# EAGLE design ADC_FPGA_I2C (EAGLE 9.5.2)
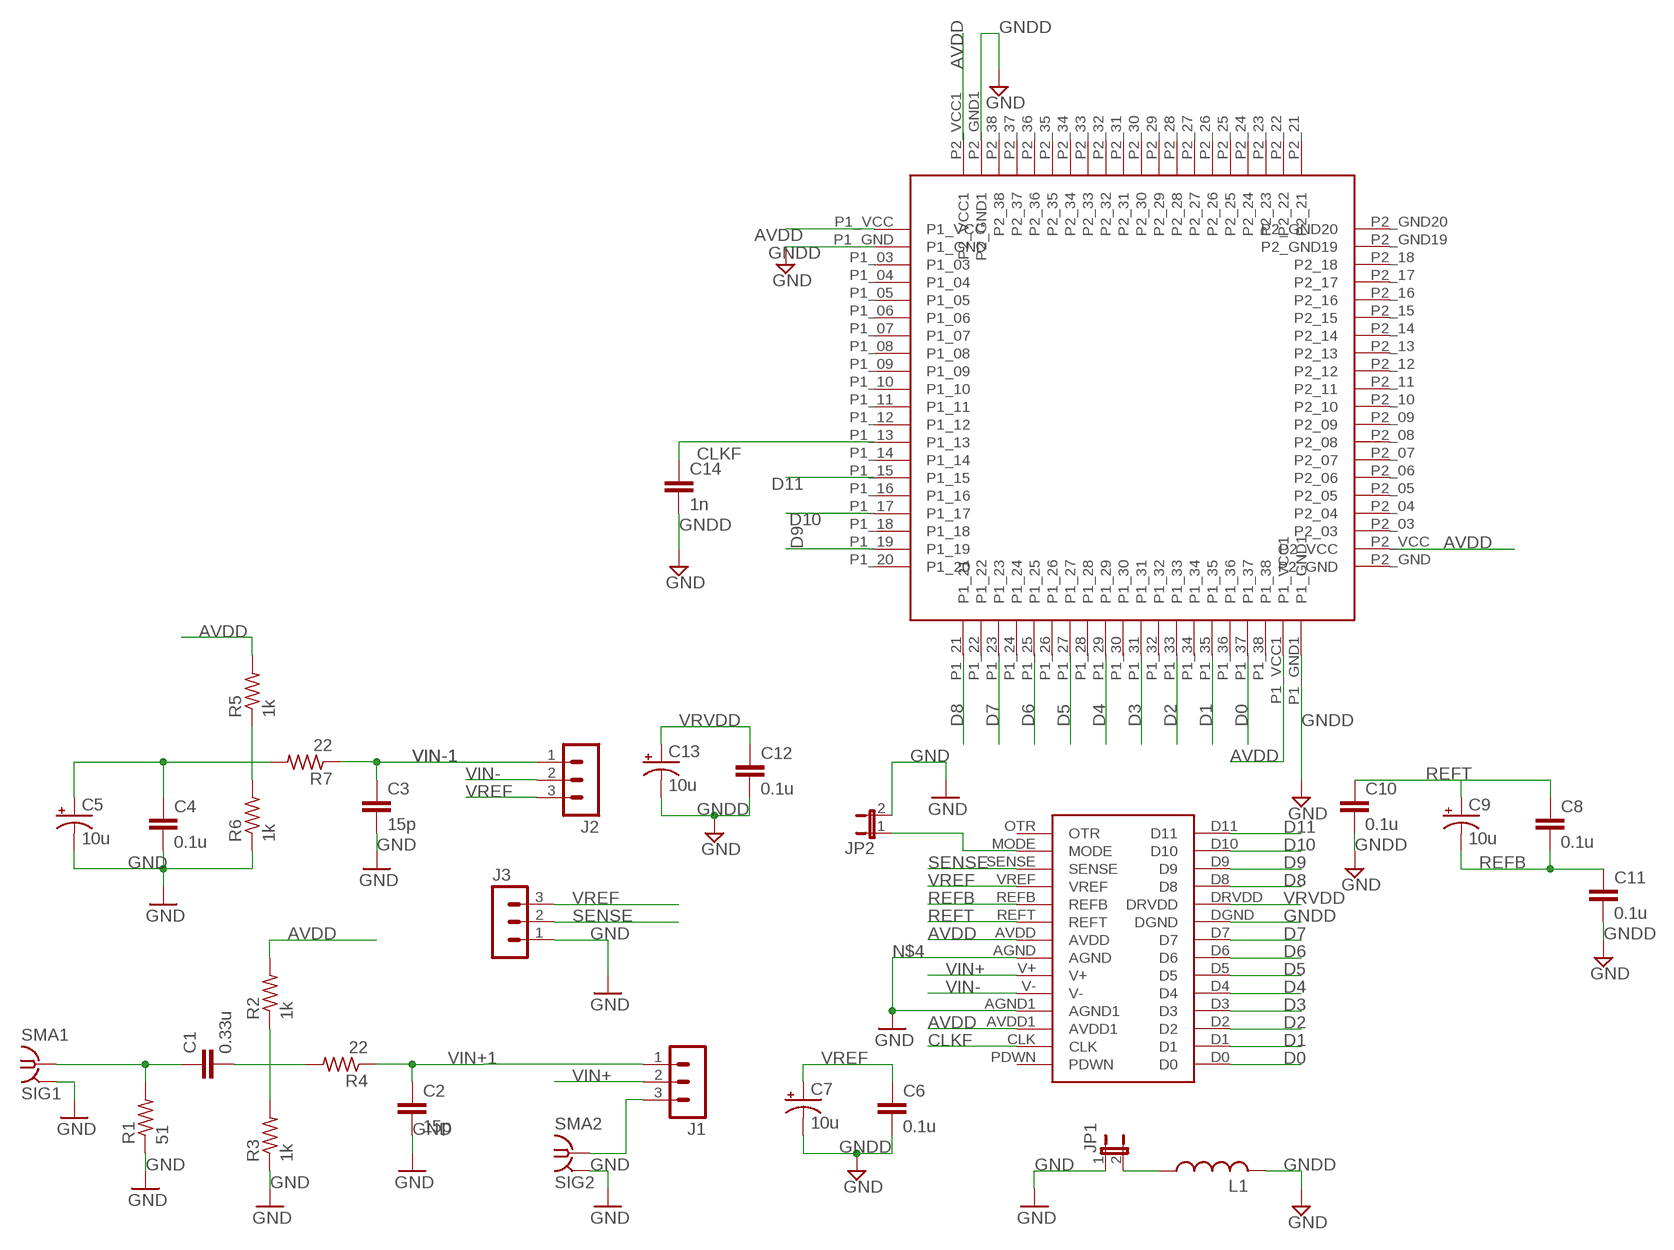
[diagram p0: schematic, sheet 1]

## Parts
C1  0.33u  C-EU075-063X106  [C075-063X106]
C2  15p  C-EU050-024X044  [C050-024X044]
C3  15p  C-EU050-024X044  [C050-024X044]
C4  0.1u  C-EU050-024X044  [C050-024X044]
C5  10u  CPOL-USE2.5-5  [E2,5-5]
C6  0.1u  C-EU050-024X044  [C050-024X044]
C7  10u  CPOL-USE2.5-5  [E2,5-5]
C8  0.1u  C-EU050-024X044  [C050-024X044]
C9  10u  CPOL-USE2.5-5  [E2,5-5]
C10  0.1u  C-EU050-024X044  [C050-024X044]
C11  0.1u  C-EU050-024X044  [C050-024X044]
C12  0.1u  C-EU050-024X044  [C050-024X044]
C13  10u  CPOL-USE2.5-5  [E2,5-5]
C14  1n  C-EU050-024X044  [C050-024X044]
J1  MA03-1  [MA03-1]
J2  MA03-1  [MA03-1]
J3  MA03-1  [MA03-1]
JP1  JP1E  [JP1]
JP2  JP1E  [JP1]
L1  L-US0204/7  [0204/7]
R1  51  R-US_0207/10  [0207/10]
R2  1k  R-US_0207/10  [0207/10]
R3  1k  R-US_0207/10  [0207/10]
R4  22  R-US_0207/10  [0207/10]
R5  1k  R-US_0207/10  [0207/10]
R6  1k  R-US_0207/10  [0207/10]
R7  22  R-US_0207/10  [0207/10]
SMA1  SIG1  SMA-142-0701-871/880  [SMA-142-0701-871]
SMA2  SIG2  SMA-142-0701-871/880  [SMA-142-0701-871]
U$1  AD9235  [AD9235]
U$2  SPARTAN_6_NIMAS  [SPARTAN_6_NIMAS]

## Nets
AVDD: R2.2 R5.2 U$1.AVDD U$1.AVDD1 U$2.P1_VCC U$2.P1_VCC1 U$2.P2_VCC U$2.P2_VCC1
CLKF: C14.1 U$1.CLK U$2.P1_13
D0: U$1.D0 U$2.P1_37
D1: U$1.D1 U$2.P1_35
D2: U$1.D2 U$2.P1_33
D3: U$1.D3 U$2.P1_31
D4: U$1.D4 U$2.P1_29
D5: U$1.D5 U$2.P1_27
D6: U$1.D6 U$2.P1_25
D7: U$1.D7 U$2.P1_23
D8: U$1.D8 U$2.P1_21
D9: U$1.D9 U$2.P1_19
D10: U$1.D10 U$2.P1_17
D11: U$1.D11 U$2.P1_15
GND: C2.2 C3.2 C4.2 C5.- J3.1 JP1.1 JP2.2 R1.1 R3.1 R6.1 SMA1.2@1 SMA1.2@2 SMA1.2@3 SMA1.2@4 SMA2.2@1 SMA2.2@2 SMA2.2@3 SMA2.2@4
GNDD: C6.2 C7.- C10.2 C11.2 C12.2 C13.- C14.2 L1.2 U$1.DGND U$2.P1_GND U$2.P1_GND1 U$2.P2_GND1 ; supply symbol labelled GND
N$1: C1.1 R1.2 SMA1.1
N$2: C1.2 R4.2
N$3: R2.1 R3.2
N$4: U$1.AGND U$1.AGND1 ; supply symbol labelled GND
N$5: J1.3 SMA2.1
N$7: C4.1 C5.+ R7.2
N$8: R5.1 R6.2
N$9: JP1.2 L1.1
N$10: JP2.1 U$1.MODE
REFB: C8.2 C9.- C11.1 U$1.REFB
REFT: C8.1 C9.+ C10.1 U$1.REFT
SENSE: J3.2 U$1.SENSE
VIN+: J1.2 U$1.V+
VIN+1: C2.1 J1.1 R4.1
VIN-: J2.2 U$1.V-
VIN-1: C3.1 J2.1 R7.1
VREF: C6.1 C7.+ J2.3 J3.3 U$1.VREF
VRVDD: C12.1 C13.+ U$1.DRVDD
Unconnected: U$1.OTR U$1.PDWN U$2.P1_03 U$2.P1_04 U$2.P1_05 U$2.P1_06 U$2.P1_07 U$2.P1_08 U$2.P1_09 U$2.P1_10 U$2.P1_11 U$2.P1_12 U$2.P1_14 U$2.P1_16 U$2.P1_18 U$2.P1_20 U$2.P1_22 U$2.P1_24 U$2.P1_26 U$2.P1_28 U$2.P1_30 U$2.P1_32 U$2.P1_34 U$2.P1_36 U$2.P1_38 U$2.P2_03 U$2.P2_04 U$2.P2_05 U$2.P2_06 U$2.P2_07 U$2.P2_08 U$2.P2_09 U$2.P2_10 U$2.P2_11 U$2.P2_12 U$2.P2_13 U$2.P2_14 U$2.P2_15 U$2.P2_16 U$2.P2_17 U$2.P2_18 U$2.P2_21 U$2.P2_22 U$2.P2_23 U$2.P2_24 U$2.P2_25 U$2.P2_26 U$2.P2_27 U$2.P2_28 U$2.P2_29 U$2.P2_30 U$2.P2_31 U$2.P2_32 U$2.P2_33 U$2.P2_34 U$2.P2_35 U$2.P2_36 U$2.P2_37 U$2.P2_38 U$2.P2_GND U$2.P2_GND19 U$2.P2_GND20

## Library data of the parts
C1-C4 C6 C8 C10-C12 C14 = rcl:C-EU: CAPACITOR, European symbol; SPICEPREFIX: C
C5 C7 C9 C13 = rcl:CPOL-US: POLARIZED CAPACITOR, American symbol; SPICEPREFIX: C
J1-J3 = con-lstb:MA03-1: PIN HEADER; OC_FARNELL: unknown; OC_NEWARK: unknown
JP1 JP2 = jumper:JP1E: JUMPER
L1 = rcl:L-US: INDUCTOR, American symbol; SPICEPREFIX: L
R1-R7 = rcl:R-US_: RESISTOR, American symbol; SPICEPREFIX: R
SMA1 SMA2 = con-coax:SMA-: SMA 50 Ohm End Launch Jack Receptacle - Round Contact Johnson Components Source: www.johnsoncomponents.com .. J502-ND.pdf; MF: JOHNSON COMPONENTS; MPN: 142-0701-871; OC_FARNELL: 1339835; OC_NEWARK: 91B6105
U$1 = AD9235:AD9235
U$2 = SPARTAN_6_NIMAS:SPARTAN_6_NIMAS

## Board
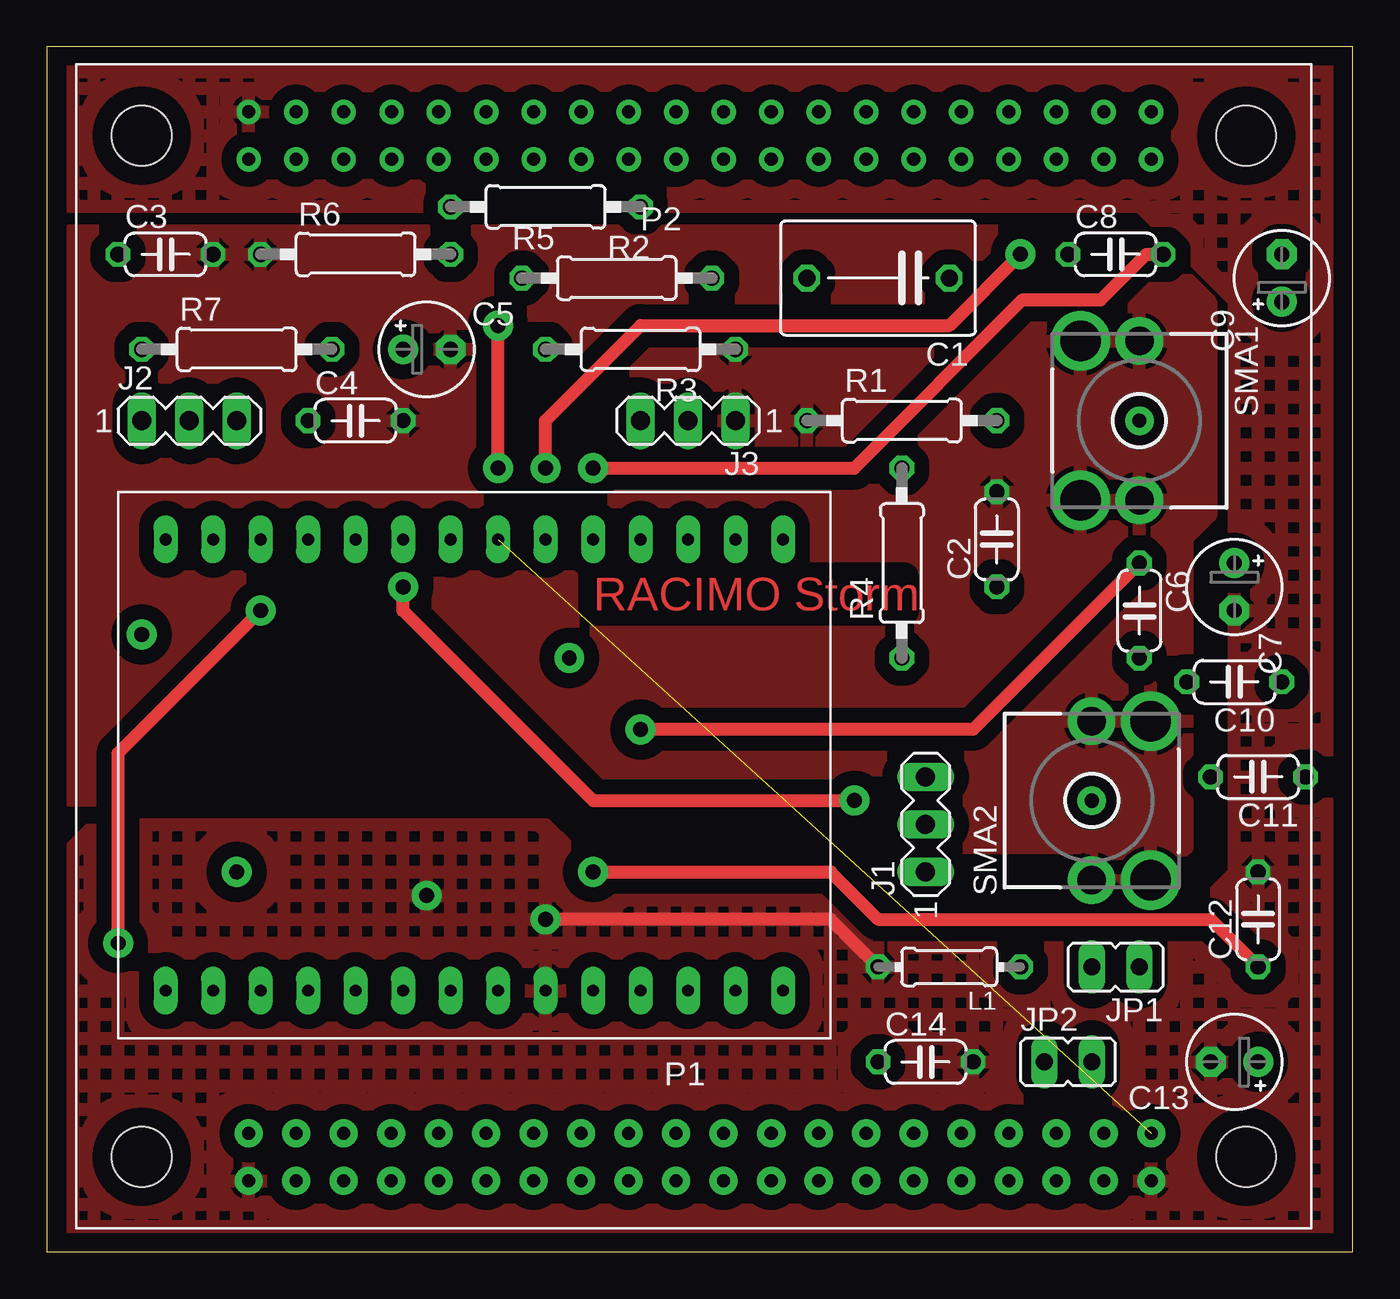
[diagram p1: board, top side]
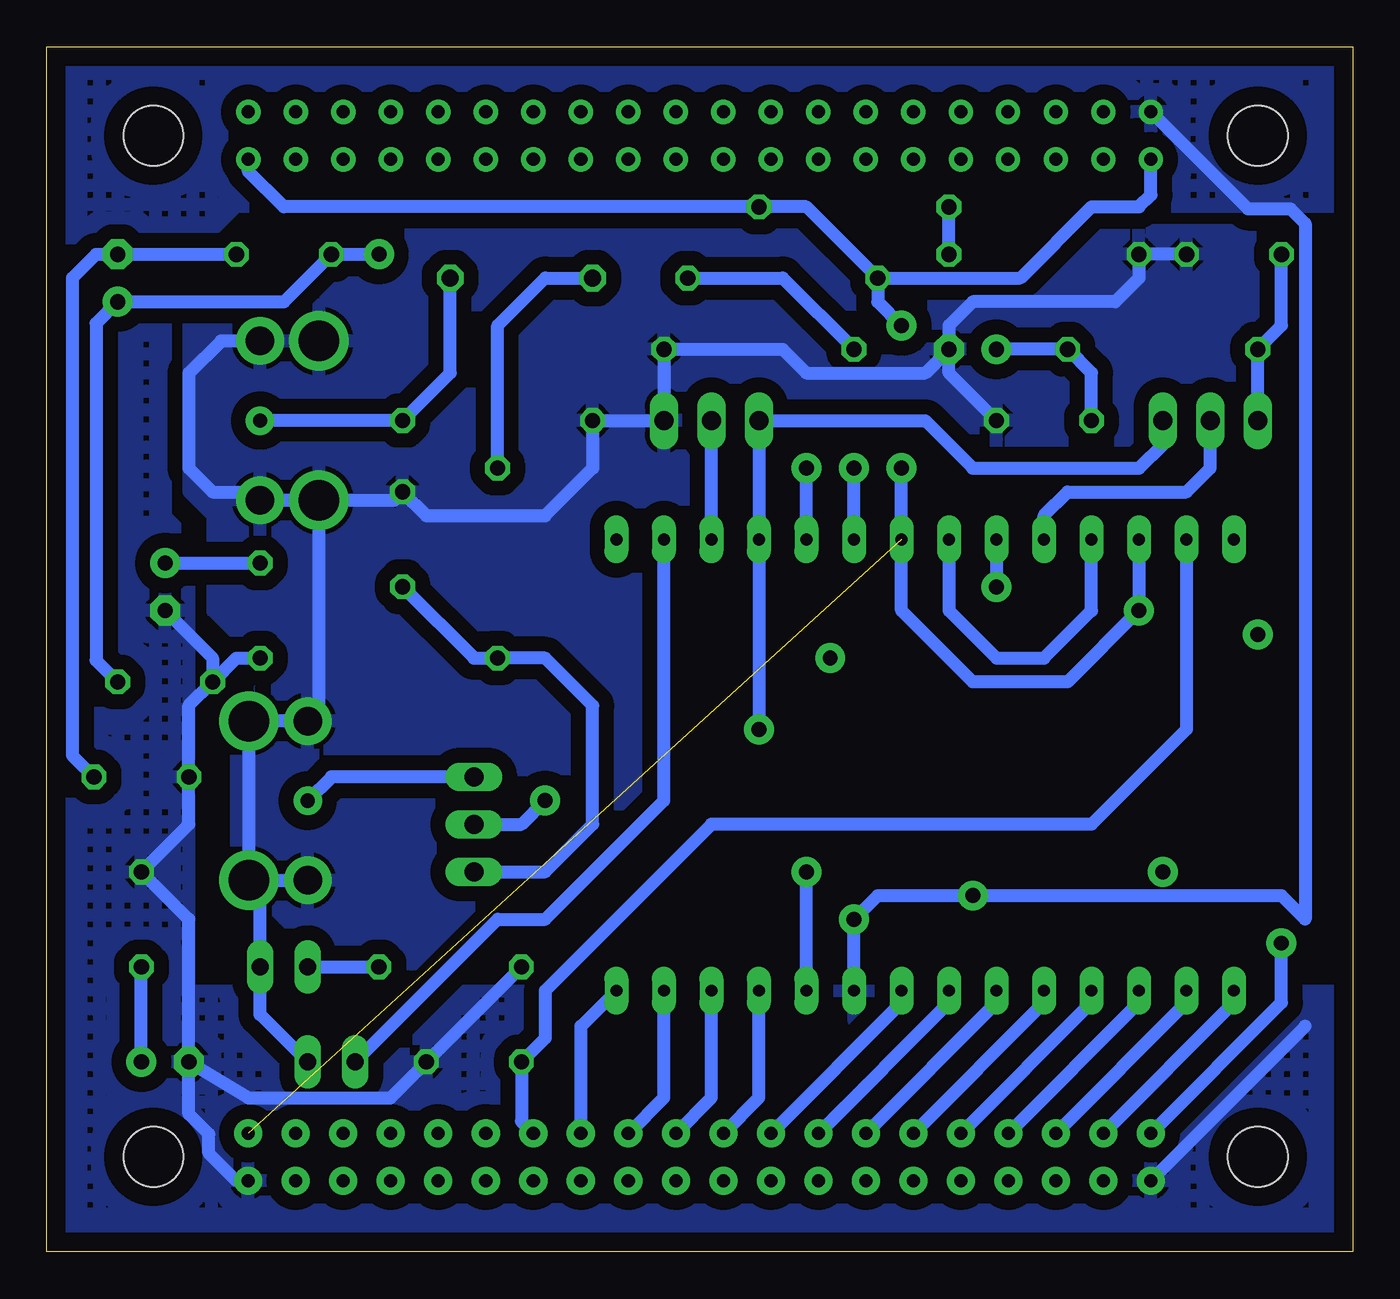
[diagram p2: board, bottom side, seen from below]

Size 69.83 x 64.44 mm. Coordinates in mm from the lower left corner, seen from the top.
Outline: 0,0 69.83,0 69.83,64.44 0,64.44 0,0
Copper layers (1*16): Top 0.035mm / dielectric 1.5mm / Bottom 0.035mm
Design rules "default": minimum track width 6mil, minimum drill 0.35mm, track to track 6mil, track to pad 6mil, pad to pad 6mil, via to via 6mil, smd to smd 6mil, copper to edge 40mil, drill to drill 6mil, minimum pad ring 10mil, minimum via ring 8mil, stop-mask expansion 4mil, vias tented up to drill 0mil, thermal gap 10mil

### Footprints (pad centres in the part's own frame; a part is rotated, then mirrored left to right if it is on the bottom)
C075-063X106 = drill 0.914 octagon: 1 -3.81,0; 2 3.81,0
C050-024X044 = drill 0.813 octagon: 1 -2.54,0; 2 2.54,0
E2,5-5 = drill 0.813 pad 1.6: + -1.27,0 | drill 0.813 pad 1.6 octagon: - 1.27,0
MA03-1 = drill 1.016 long: 1 -2.54,0; 2 0,0; 3 2.54,0
JP1 = drill 0.914 long: 1 0,-1.27; 2 0,1.27
0204/7 = drill 0.813 octagon: 1 -3.81,0; 2 3.81,0
0207/10 = drill 0.813 octagon: 1 -5.08,0; 2 5.08,0
SMA-142-0701-871 = drill 0.762 pad 1.524: 1 0,0 | drill 1.524 pad 2.54: 2@1 -4.255,0; 2@2 4.255,0 | drill 2.159 pad 2.794: 2@3 -4.255,-3.15; 2@4 4.255,-3.15
AD9235 = drill 0.635 pad 1.27 long: AGND 0,-17.78; AGND1 0,-25.4; AVDD 0,-15.24; AVDD1 0,-27.94; CLK 0,-30.48; D0 24.13,-33.02; D1 24.13,-30.48; D2 24.13,-27.94; D3 24.13,-25.4; D4 24.13,-22.86; D5 24.13,-20.32; D6 24.13,-17.78; D7 24.13,-15.24; D8 24.13,-7.62; D9 24.13,-5.08; D10 24.13,-2.54; D11 24.13,0; DGND 24.13,-12.7; DRVDD 24.13,-10.16; MODE 0,-2.54; OTR 0,0; PDWN 0,-33.02; REFB 0,-10.16; REFT 0,-12.7; SENSE 0,-5.08; V+ 0,-20.32; V- 0,-22.86; VREF 0,-7.62
SPARTAN_6_NIMAS = drill 0.7 pad 1.5: P1_03 51.435,-53.34; P1_04 51.435,-55.88; P1_05 48.895,-53.34; P1_06 48.895,-55.88; P1_07 46.355,-53.34; P1_08 46.355,-55.88; P1_09 43.815,-53.34; P1_10 43.815,-55.88; P1_11 41.275,-53.34; P1_12 41.275,-55.88; P1_13 38.735,-53.34; P1_14 38.735,-55.88; P1_15 36.195,-53.34; P1_16 36.195,-55.88; P1_17 33.655,-53.34; P1_18 33.655,-55.88; P1_19 31.115,-53.34; P1_20 31.115,-55.88; P1_21 28.575,-53.34; P1_22 28.575,-55.88; P1_23 26.035,-53.34; P1_24 26.035,-55.88; P1_25 23.495,-53.34; P1_26 23.495,-55.88; P1_27 20.955,-53.34; P1_28 20.955,-55.88; P1_29 18.415,-53.34; P1_30 18.415,-55.88; P1_31 15.875,-53.34; P1_32 15.875,-55.88; P1_33 13.335,-53.34; P1_34 13.335,-55.88; P1_35 10.795,-53.34; P1_36 10.795,-55.88; P1_37 8.255,-53.34; P1_38 8.255,-55.88; P1_GND 53.975,-55.88; P1_GND1 5.715,-55.88; P1_VCC 53.975,-53.34; P1_VCC1 5.715,-53.34 | drill 0.7 pad 1.3: P2_03 51.435,1.27; P2_04 51.435,-1.27; P2_05 48.895,1.27; P2_06 48.895,-1.27; P2_07 46.355,1.27; P2_08 46.355,-1.27; P2_09 43.815,1.27; P2_10 43.815,-1.27; P2_11 41.275,1.27; P2_12 41.275,-1.27; P2_13 38.735,1.27; P2_14 38.735,-1.27; P2_15 36.195,1.27; P2_16 36.195,-1.27; P2_17 33.655,1.27; P2_18 33.655,-1.27; P2_21 28.575,1.27; P2_22 28.575,-1.27; P2_23 26.035,1.27; P2_24 26.035,-1.27; P2_25 23.495,1.27; P2_26 23.495,-1.27; P2_27 20.955,1.27; P2_28 20.955,-1.27; P2_29 18.415,1.27; P2_30 18.415,-1.27; P2_31 15.875,1.27; P2_32 15.875,-1.27; P2_33 13.355,1.27; P2_34 13.355,-1.27; P2_35 10.795,1.27; P2_36 10.795,-1.27; P2_37 8.255,1.27; P2_38 8.255,-1.27; P2_GND 53.975,1.27; P2_GND1 5.715,1.27; P2_GND19 31.115,1.27; P2_GND20 31.115,-1.27; P2_VCC 53.975,-1.27; P2_VCC1 5.715,-1.27 | hole 3.2: 0,0; 0,-54.61; 59.05,0; 59.05,-54.61

### Placement (x,y rotation side)
C1  44.45,52.07 180 top
C2  50.8,38.1 90 top
C3  6.35,53.34 0 top
C4  16.51,44.45 0 top
C5  20.32,48.26 0 top
C6  58.42,34.29 270 top
C7  63.5,35.56 270 top
C8  57.15,53.34 0 top
C9  66.04,52.07 90 top
C10  63.5,30.48 180 top
C11  64.77,25.4 180 top
C12  64.77,17.78 90 top
C13  63.5,10.16 180 top
C14  46.99,10.16 0 top
J1  46.99,22.86 90 top
J2  7.62,44.45 0 top
J3  34.29,44.45 180 top
JP1  57.15,15.24 90 top
JP2  54.61,10.16 270 top
L1  48.26,15.24 180 top
R1  45.72,44.45 0 top
R2  30.48,52.07 180 top
R3  31.75,48.26 180 top
R4  45.72,36.83 90 top
R5  26.67,55.88 0 top
R6  16.51,53.34 0 top
R7  10.16,48.26 0 top
SMA1  58.42,44.45 270 top
SMA2  55.88,24.13 90 top
U$1  39.37,38.1 270 top
U$2  5.08,59.69 0 top

### Tracks (layer width: path | path; a pad name or v marks a point on that pad's centre or on a via)
AVDD  (via drill 0.8 pad 1.6)  (1 unrouted)
  Top 0.7: v24.13,41.91 v24.13,49.53 | v3.81,16.51 3.81,26.67 v11.43,34.29
  Bottom 0.7: R2.2 29.21,55.88 R5.2 57.15,55.88 59.05,57.78 U$2.P2_VCC | R2.2 17.78,52.07 13.97,55.88 11.43,55.88 10.79,56.52 U$2.P2_VCC1 | U$1.AVDD1 v11.43,34.29 15.24,30.48 20.32,30.48 24.13,34.29 U$1.AVDD v24.13,41.91 | R2.2 25.4,50.8 v24.13,49.53 | U$2.P1_VCC1 3.81,13.34 v3.81,16.51
CLKF
  Bottom 0.7: U$1.CLK 8.89,27.94 13.97,22.86 34.29,22.86 43.18,13.97 43.18,11.43 C14.1 44.45,6.99 U$2.P1_13
D0
  Bottom 0.7: U$2.P1_37 6.35,13.34 U$1.D0
D1
  Bottom 0.7: U$2.P1_35 8.89,13.34 U$1.D1
D2
  Bottom 0.7: U$2.P1_33 11.43,13.34 U$1.D2
D3
  Bottom 0.7: U$2.P1_31 13.97,13.34 U$1.D3
D4
  Bottom 0.7: U$2.P1_29 16.51,13.34 U$1.D4
D5
  Bottom 0.7: U$2.P1_27 19.05,13.34 U$1.D5
D6
  Bottom 0.7: U$2.P1_25 21.59,13.34 U$1.D6
D7
  Bottom 0.7: U$2.P1_23 24.13,13.34 U$1.D7
D8
  Bottom 0.7: U$2.P1_21 31.75,8.26 U$1.D8
D9
  Bottom 0.7: U$2.P1_19 34.29,8.26 U$1.D9
D10
  Bottom 0.7: U$2.P1_17 36.83,8.26 U$1.D10
D11
  Bottom 0.7: U$2.P1_15 41.27,12.06 U$1.D11
GND
  Bottom 0.7: C4.2 21.59,46.99 C5.- | C3.2 R6.1 11.43,52.07 12.7,50.8 20.32,50.8 21.59,49.53 C5.- | JP2.2 58.42,12.7 JP1.1 58.42,19.27 SMA2.2@3 | SMA2.2@3 SMA2.2@4 SMA2.2@2 55.27,28.99 SMA1.2@4 | SMA2.2@3 SMA2.2@1 | SMA1.2@2 SMA1.2@4 | SMA1.2@4 51.24,40.2 C2.2 49.53,39.37 43.18,39.37 40.64,41.91 R1.1 J3.1 R3.1 30.48,48.26 29.21,46.99 22.86,46.99 C5.- | SMA1.2@1 60.52,48.7 62.23,46.99 62.23,41.91 60.96,40.64 58.42,40.64
  pour Bottom (isolate 0.8): 1.27,54.61 55.88,54.61 57.15,53.34 60.96,53.34 62.23,52.07 62.23,40.64 60.96,39.37 60.96,35.56 60.96,34.29 58.42,31.75 58.42,29.21 59.69,27.94 59.69,20.32 57.15,17.78 54.61,15.24 50.8,15.24 48.26,15.24 45.72,17.78 41.91,17.78 35.56,24.13 1.27,24.13
  pour Top (isolate 0.8): 1.27,54.61 58.42,54.61 62.23,50.8 62.23,39.37 60.96,38.1 60.96,21.59 58.42,19.05 55.88,21.59 41.91,21.59 39.37,24.13 1.27,24.13
GNDD  (via drill 0.8 pad 1.6)
  Top 0.7: L1.2 41.91,17.78 v26.67,17.78
  Bottom 0.7: C13.- 59.03,8.23 51.45,8.23 C14.2 L1.2 | C10.2 59.69,31.75 C6.2 | C7.- 60.96,31.75 C10.2 | C10.2 62.23,29.21 C11.2 62.23,22.86 C12.2 62.23,17.78 C13.- | U$2.P1_GND 59.69,3.81 61.16,5.28 61.16,6.31 62.23,7.38 C13.- | U$1.DGND v26.67,17.78 25.4,19.05 v20.32,19.05 3.81,19.05 2.54,17.78 2.54,54.98 3.33,55.77 5.61,55.77 U$2.P2_GND1 | U$2.P1_GND1 2.54,12.06
  pour Bottom (isolate 0.8, hatched): 0,0 69.85,0 69.85,64.77 0,64.77 0,55.88 59.69,55.88 63.5,52.07 63.5,39.37 62.23,38.1 62.23,13.97 0,13.97
  pour Top (isolate 0.8, hatched): 1.27,63.5 68.58,63.5 68.58,1.27 1.27,1.27 1.27,21.59 2.54,22.86 26.67,22.86 27.94,21.59 40.64,21.59 44.45,17.78 60.96,17.78 63.5,20.32 63.5,50.8 58.42,55.88 1.27,55.88
N$1
  Bottom 0.7: SMA1.1 R1.2 48.26,46.99 C1.1
N$2
  Bottom 0.7: R4.2 45.72,49.53 43.18,52.07 C1.2
N$3
  Bottom 0.7: R2.1 30.48,52.07 R3.2
N$4
  Bottom 0.7: U$1.AGND 21.59,34.29 19.05,31.75 16.51,31.75 13.97,34.29 U$1.AGND1
N$5
  Bottom 0.7: J1.3 54.61,25.4 SMA2.1
N$6  (via drill 0.8 pad 1.6)
  other vias: 10.16,20.32
N$7
  Bottom 0.7: C4.1 13.97,46.99 R7.2 C5.+
N$8
  Bottom 0.7: R6.2 R5.1
N$9
  Bottom 0.7: JP1.2 L1.1
N$10
  Bottom 0.7: JP2.1 45.72,17.78 43.18,17.78 36.83,24.13 U$1.MODE
N$11  (via drill 0.8 pad 1.6)
  other vias: 5.08,33.02
N$12  (via drill 0.8 pad 1.6)
  other vias: 27.94,31.75
REFB  (via drill 0.8 pad 1.6)
  Top 0.7: C8.2 58.79,53.34 56.36,50.91 52.18,50.91 43.18,41.91 v29.21,41.91
  Bottom 0.7: C8.2 C9.- 67.19,53.34 68.46,52.07 68.46,26.55 C11.1 | U$1.REFB v29.21,41.91
REFT  (via drill 0.8 pad 1.6)
  Top 0.7: v26.67,41.91 26.67,44.45 31.75,49.53 48.26,49.53 v52.07,53.34
  Bottom 0.7: C10.1 67.19,31.63 67.19,49.65 C9.+ 57.15,50.8 C8.1 v52.07,53.34 | U$1.REFT v26.67,41.91
SENSE
  Bottom 0.7: U$1.SENSE J3.2
VIN+  (via drill 0.8 pad 1.6)
  Top 0.7: v19.05,35.56 19.05,34.29 29.21,24.13 v43.18,24.13
  Bottom 0.7: J1.2 44.45,22.86 v43.18,24.13 | U$1.V+ v19.05,35.56
VIN+1
  Bottom 0.7: C2.1 46.99,31.75 R4.1 43.18,31.75 40.64,29.21 40.64,22.86 43.18,20.32 J1.1
VIN-
  Bottom 0.7: U$1.V- 16.51,39.37 15.24,40.64 8.89,40.64 7.62,41.91 J2.2
VIN-1
  Bottom 0.7: J2.1 R7.1 3.81,49.53 C3.1
VREF  (via drill 0.8 pad 1.6)
  Top 0.7: C6.1 49.53,27.94 v31.75,27.94
  Bottom 0.7: J2.3 10.16,43.18 11.43,41.91 20.32,41.91 22.86,44.45 J3.3 U$1.VREF v31.75,27.94 | C7.+ C6.1
VRVDD  (via drill 0.8 pad 1.6)
  Top 0.7: v29.21,20.32 41.91,20.32 44.45,17.78 62.23,17.78 C12.1
  Bottom 0.7: C13.+ C12.1 | U$1.DRVDD v29.21,20.32

### Text on the board
Top: RACIMO Storm